# EAGLE schematic LEDCube_Par_Conn (EAGLE 5.09)
REICHELT: TASTER 3301
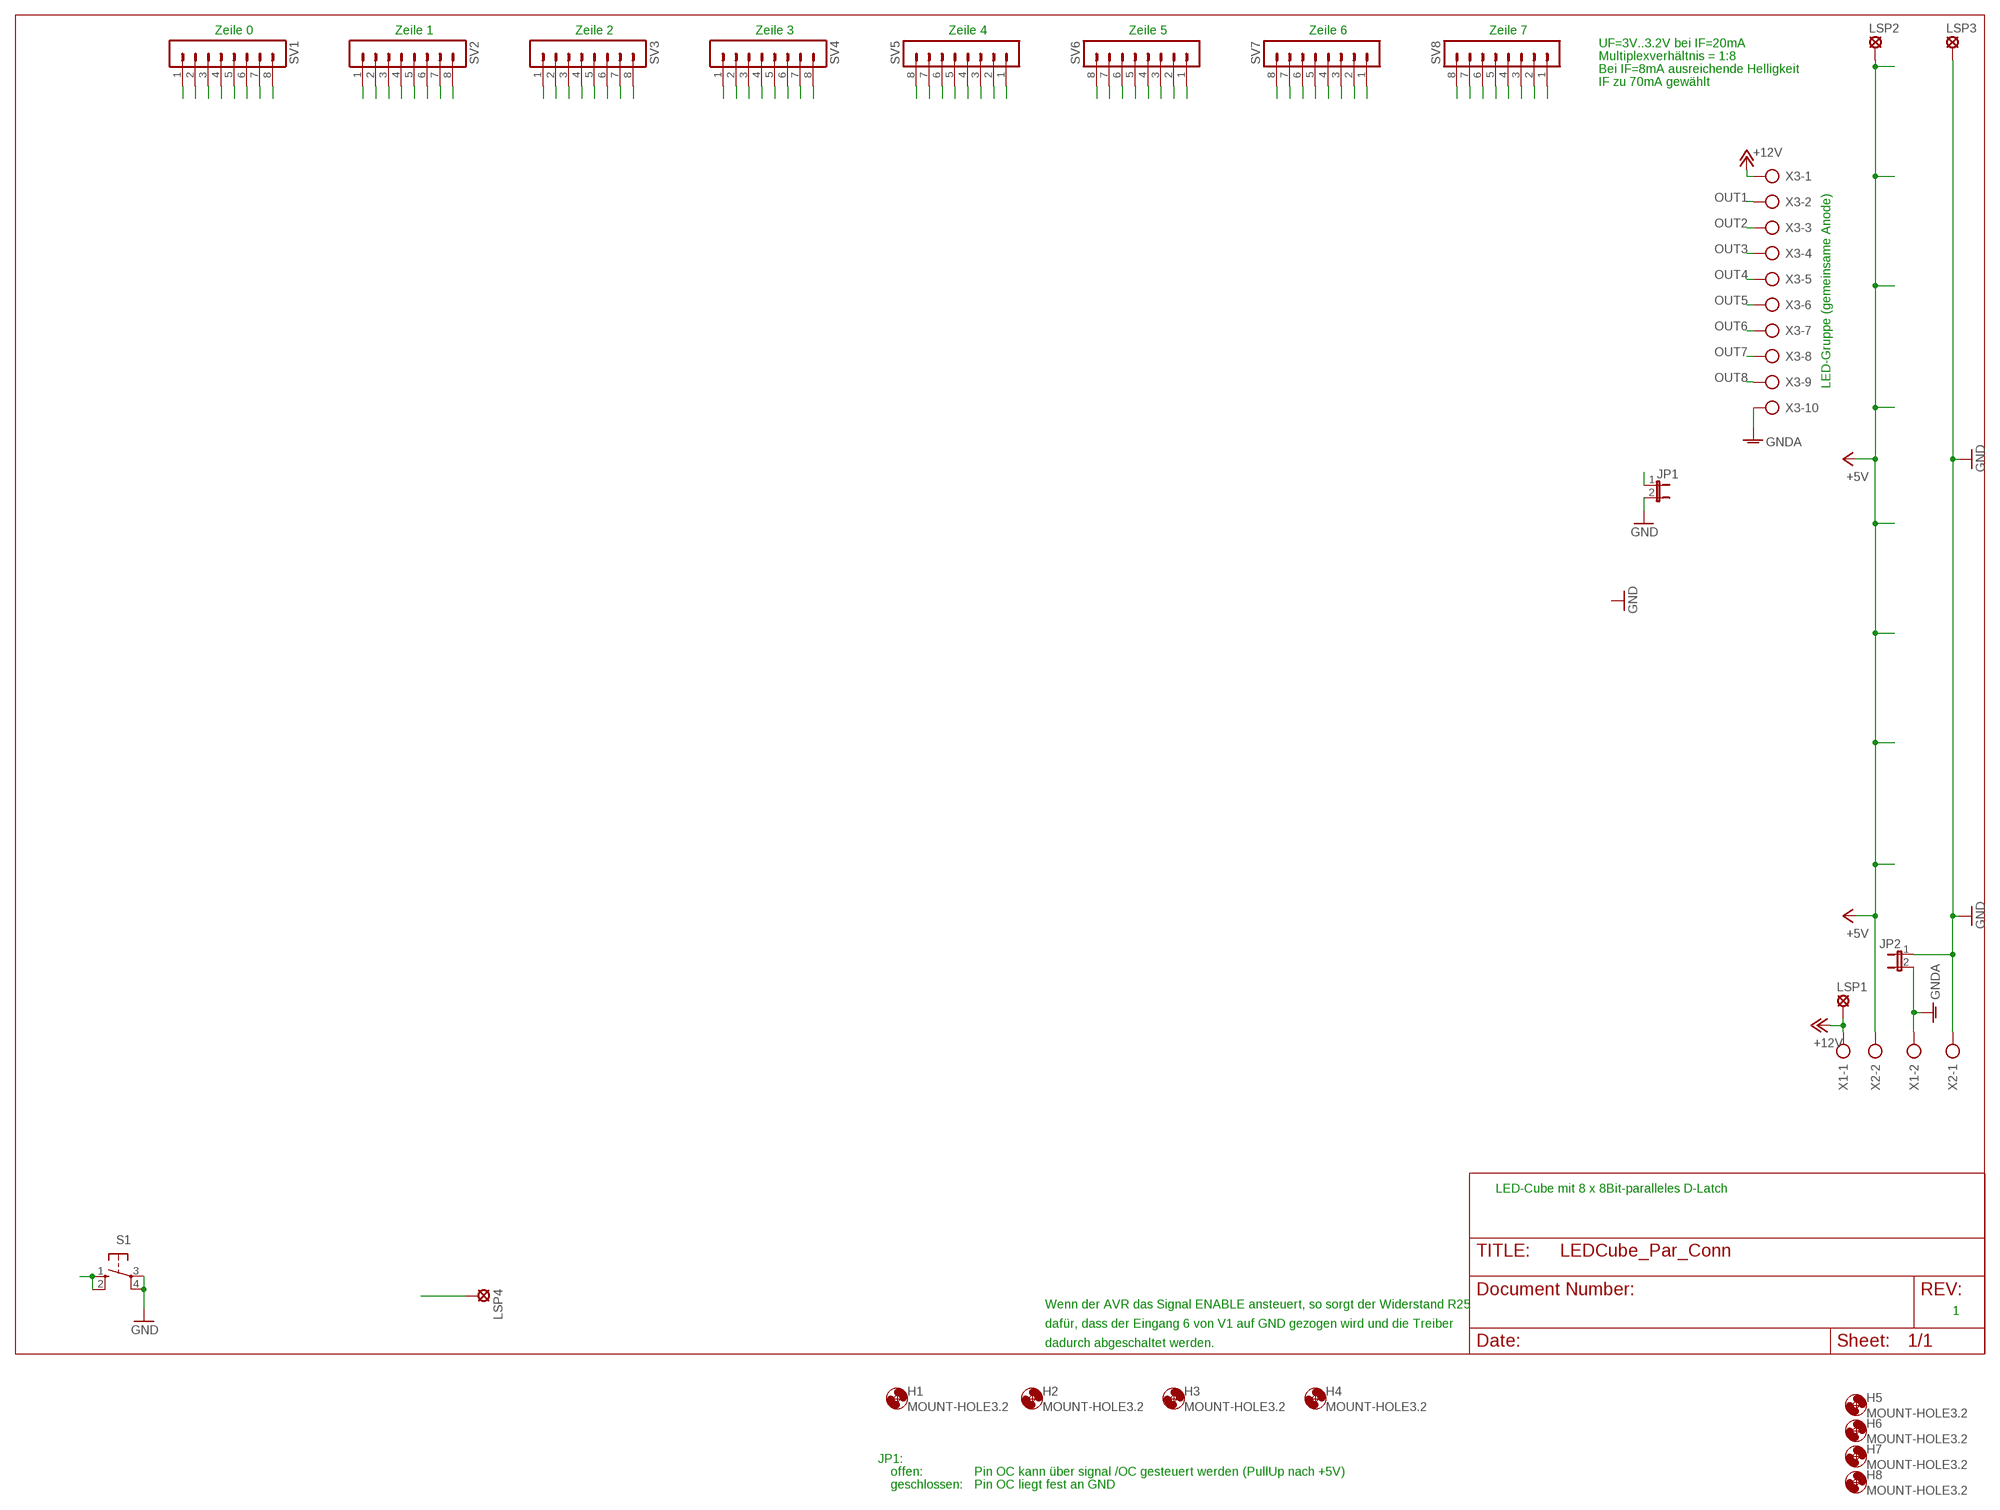
[diagram p0: schematic, sheet 1]

## Parts
H1  MOUNT-HOLE3.2  [3,2]
H2  MOUNT-HOLE3.2  [3,2]
H3  MOUNT-HOLE3.2  [3,2]
H4  MOUNT-HOLE3.2  [3,2]
H5  MOUNT-HOLE3.2  [3,2]
H6  MOUNT-HOLE3.2  [3,2]
H7  MOUNT-HOLE3.2  [3,2]
H8  MOUNT-HOLE3.2  [3,2]
JP1  JP1E  [JP1]
JP2  JP1E  [JP1]
LSP1  LSP10  [LSP10]
LSP2  LSP10  [LSP10]
LSP3  LSP10  [LSP10]
LSP4  LSP11  [LSP11]
S1  10-XX  [B3F-10XX]
SV1  MA08-1  [MA08-1]
SV2  MA08-1  [MA08-1]
SV3  MA08-1  [MA08-1]
SV4  MA08-1  [MA08-1]
SV5  MA08-1  [MA08-1]
SV6  MA08-1  [MA08-1]
SV7  MA08-1  [MA08-1]
SV8  MA08-1  [MA08-1]
X1  AK500/2  [AK500/2]
X2  AK500/2  [AK500/2]
X3  AK500/10  [AK500/10]

## Nets
+5V: LSP2.MP X2.2
+12V: LSP1.MP X1.1 X3.1
GND: JP1.2 JP2.1 LSP3.MP S1.3(P) S1.4(P1) X2.1
GNDA: JP2.2 X1.2 X3.10
N$10: JP1.1
N$33: LSP4.MP
N$34: SV7.8
N$35: SV7.7
N$36: SV7.6
N$37: SV7.5
N$38: SV7.4
N$39: SV7.3
N$40: SV7.2
N$41: SV7.1
N$44: SV6.8
N$63: SV1.1
N$109: SV6.7
N$110: SV6.6
N$111: SV6.5
N$112: SV6.4
N$113: SV6.3
N$114: SV6.2
N$115: SV6.1
N$122: SV1.2
N$123: SV1.3
N$124: SV1.4
N$125: SV1.5
N$126: SV1.6
N$127: SV1.7
N$128: SV1.8
N$129: SV2.1
N$150: SV2.2
N$158: SV5.8
N$159: SV5.7
N$160: SV5.6
N$161: SV5.5
N$162: SV5.4
N$163: SV5.3
N$164: SV5.2
N$165: SV5.1
N$166: SV8.8
N$167: SV2.3
N$168: SV2.4
N$169: SV2.5
N$170: SV2.6
N$171: SV2.7
N$172: SV2.8
N$173: SV3.1
N$174: SV3.2
N$175: SV3.3
N$176: SV3.4
N$177: SV3.5
N$178: SV3.6
N$179: SV3.7
N$180: SV3.8
N$181: SV4.1
N$182: SV4.2
N$183: SV4.3
N$184: SV4.4
N$185: SV4.5
N$186: SV4.6
N$187: SV4.7
N$188: SV4.8
N$189: SV8.7
N$190: SV8.6
N$191: SV8.5
N$192: SV8.4
N$193: SV8.3
N$194: SV8.2
N$195: SV8.1
OUT1: X3.2
OUT2: X3.3
OUT3: X3.4
OUT4: X3.5
OUT5: X3.6
OUT6: X3.7
OUT7: X3.8
OUT8: X3.9
RESET: S1.1(S) S1.2(S1)

## Notes on the sheet
- Zeile 0 | Zeile 1 | Zeile 2 | Zeile 3 | Zeile 4 | Zeile 5 | Zeile 6 | Zeile 7
- UF=3V..3.2V bei IF=20mA
- Multiplexverhältnis = 1:8
- Bei IF=8mA ausreichende Helligkeit
- IF zu 70mA gewählt
- LED-Gruppe (gemeinsame Anode)
- LED-Cube mit 8 x 8Bit-paralleles D-Latch
- Wenn der AVR das Signal ENABLE ansteuert, so sorgt der Widerstand R25
- 1
- dafür, dass der Eingang 6 von V1 auf GND gezogen wird und die Treiber
- dadurch abgeschaltet werden.
- JP1:
- offen: | Pin OC kann über signal /OC gesteuert werden (PullUp nach +5V)
- geschlossen: | Pin OC liegt fest an GND

## Library data of the parts
H1-H8 = holes:MOUNT-HOLE: MOUNTING HOLE with drill center marker
JP1 JP2 = bbstghs:JP1E: JUMPER
LSP1-LSP3 = solpad:LSP10: SOLDER PAD drill 1.0 mm, distributor Buerklin, 12H555
LSP4 = solpad:LSP11: SOLDER PAD drill 1.1 mm
S1 = switch-omron:10-XX: OMRON SWITCH
SV1-SV8 = con-lstb:MA08-1: PIN HEADER
X1 X2 = bbstghs:AK500/2: CONNECTOR
X3 = con-ptr500:AK500/10: CONNECTOR